# Altium schematic sheet P1.schdoc (part 2 of 3)
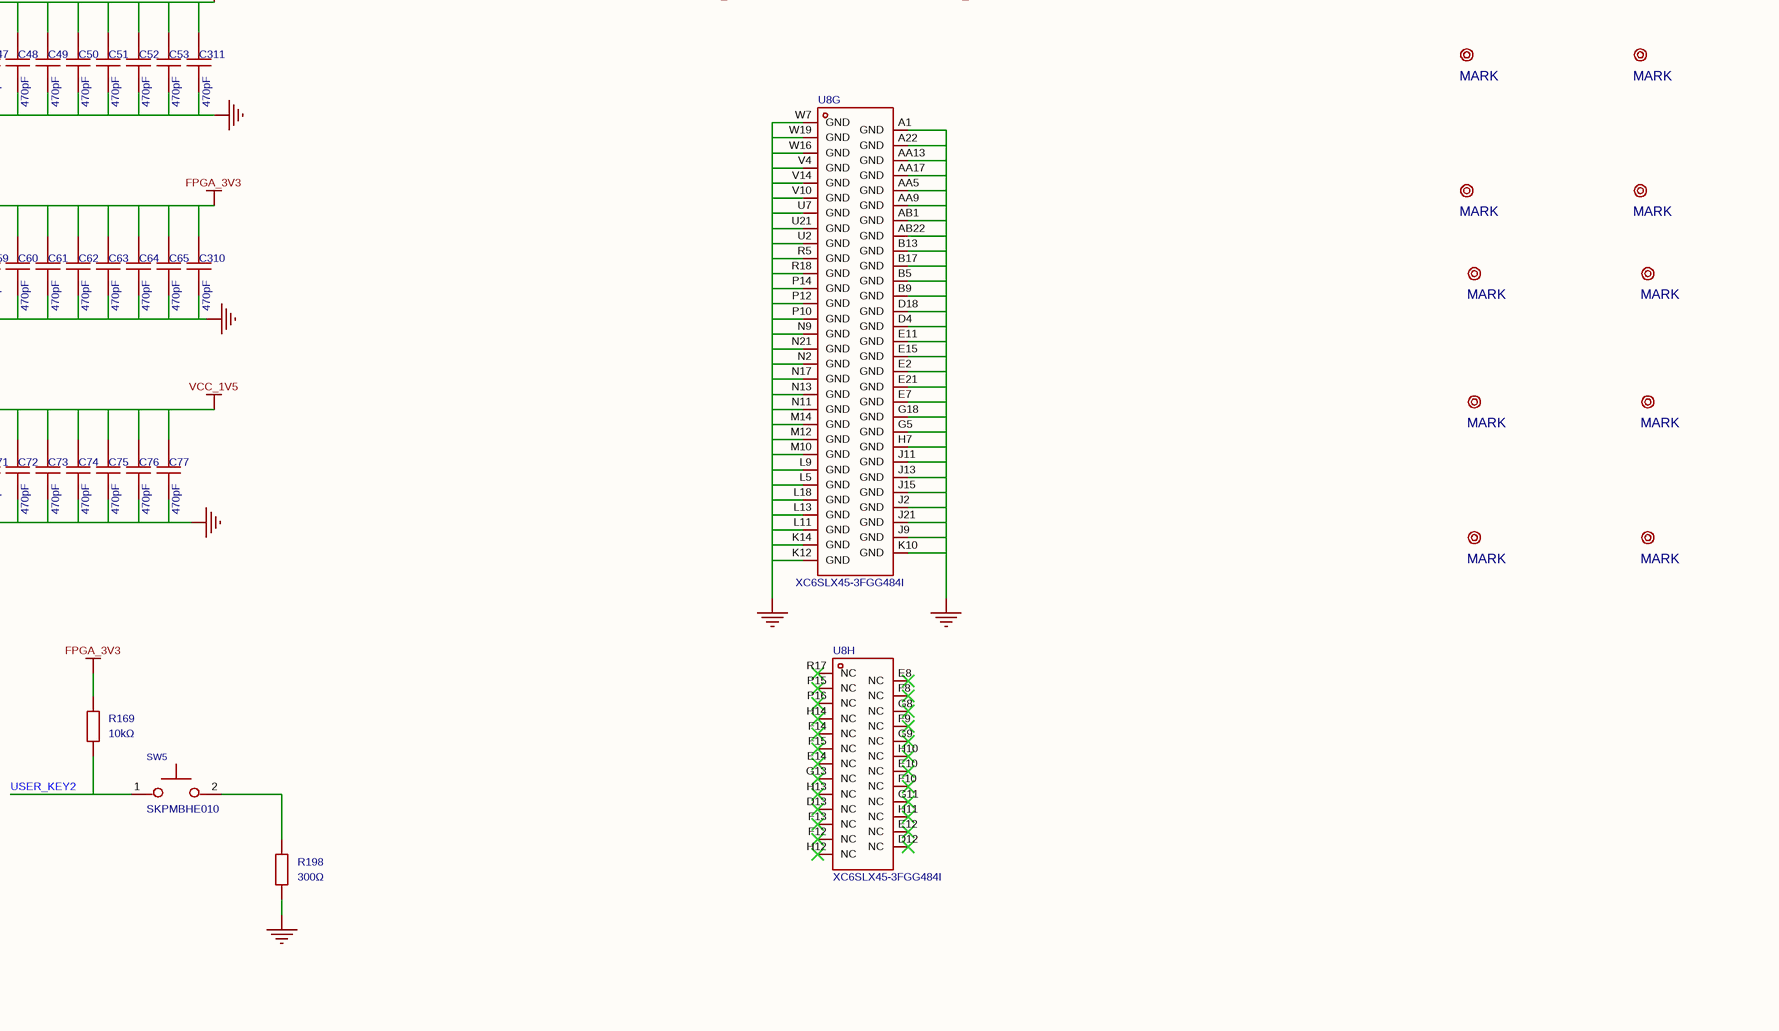
[diagram p12: P1.schdoc, bottom column 4 of 4]
## Library data of the parts
C1-C4 C118 C147-C149 = GRM188R71H104KA93D: 容值:100nF;精度:±10%;额定电压:50V;材质(温度系数):X7R;; Manufacturer: muRata(村田); AddInBom: yes; ModelId: ac125912035d415993ca9572d50418b1; ModelName: C0603_L1.6-W0.8-H0.8; ModelTransform: 62.992,31.496,0,0,0,0,0,0,0; Tolerance: ±10%; Voltage Rated: 50V; Temperature Coefficient: X7R; Symbol: GRM188R71H104KA93D; Device: GRM188R71H104KA93D; LCSC Part Name: 100nF ±10% 50V; SupplierPart: C77055; ManufacturerPart: GRM188R71H104KA93D; Supplier Footprint: 0603; JLCPCB Part Class: 扩展库; Datasheet: https://atta.szlcsc.com/upload/public/pdf/source/20200305/C490387_23319AE8C154DEB24C505E6C82A8106A.pdf; Supplier: LCSC; ConvertToPcb: yes; FootprintName: C0603; Value: 100nF
C5 C17 C30 C42 C54 C66 = GRM32ER60J107ME20L: 容值:100uF;精度:±20%;额定电压:6.3V;材质(温度系数):X5R;; Manufacturer: muRata(村田); AddInBom: yes; ModelId: 113f675d30df4856af7632edb7ada0df; ModelName: C1210_L3.2-W2.5-H0.9; ModelTransform: 125.984,99.2124,0,0,0,0,0,0,0; Tolerance: ±20%; Voltage Rated: 6.3V; Temperature Coefficient: X5R; Symbol: GRM32ER60J107ME20L; Device: GRM32ER60J107ME20L; Supplier: LCSC; Manufacturer Part: GRM32ER60J107ME20L; Value: 100uF; Supplier Part: C88154; JLCPCB Part Class: 扩展库; LCSC Part Name: 100uF ±20% 6.3V; Supplier Footprint: 1210; Datasheet: https://atta.szlcsc.com/upload/public/pdf/source/20170116/1484561244372.pdf; ConvertToPcb: yes; FootprintName: C1210
C6 C18 C29 C31 C43 C55 C67 = GRM188R61C475KE11D: 容值:4.7uF;精度:±10%;额定电压:16V;材质(温度系数):X5R;; Manufacturer: muRata(村田); Symbol: GCM21BR71C475KA73L; AddInBom: yes; ModelId: ac125912035d415993ca9572d50418b1; ModelName: C0603_L1.6-W0.8-H0.8; ModelTransform: 62.992,31.496,0,0,0,0,0,0,0; Tolerance: ±10%; Voltage Rated: 16V; Temperature Coefficient: X5R; Device: GRM188R61C475KE11D; Supplier: LCSC; Manufacturer Part: GRM188R61C475KE11D; Value: 4.7uF; Supplier Part: C77045; JLCPCB Part Class: Extended Part; LCSC Part Name: 4.7uF ±10% 16V; Supplier Footprint: 0603; Datasheet: https://atta.szlcsc.com/upload/public/pdf/source/20200305/C490387_23319AE8C154DEB24C505E6C82A8106A.pdf; ConvertToPcb: yes; FootprintName: C0603
C7-C16 C19-C25 C32-C41 C44-C53 C56-C65 C68-C77 C293-C311 = GRM155R71H471JA01D: 容值:470pF;精度:±5%;额定电压:50V;材质(温度系数):X7R;; Manufacturer: muRata(村田); AddInBom: yes; ModelId: 36a51122f27c49738f86b3bfa98863e0; ModelName: C0402_L1.0-W0.5-H0.5; ModelTransform: 39.37,19.685,0,0,0,0,0,0,0; Tolerance: ±5%; Voltage Rated: 50V; Temperature Coefficient: X7R; JLCPCB Part Class: Extended Part; Symbol: GRM155R71H471JA01D; Device: GRM155R71H471JA01D; Supplier: LCSC; Supplier Part: C415539; Manufacturer Part: GRM155R71H471JA01D; Value: 470pF; LCSC Part Name: 470pF ±5% 50V; Supplier Footprint: 0402; Datasheet: https://atta.szlcsc.com/upload/public/pdf/source/20200305/C490387_23319AE8C154DEB24C505E6C82A8106A.pdf; ConvertToPcb: yes; FootprintName: C0402
C78-C106 C108 C110 C119 C124 C129 C132 C133 C135 C136 C150 C157-C159 C162 C173 C210 C217-C251 = GCM155R71A104KA55D: 容值:100nF;精度:±10%;额定电压:10V;材质(温度系数):X7R;; Manufacturer: muRata(村田); AddInBom: yes; ModelId: 36a51122f27c49738f86b3bfa98863e0; ModelName: C0402_L1.0-W0.5-H0.5; ModelTransform: 39.37,19.685,0,0,0,0,0,0,0; Tolerance: ±10%; Voltage Rated: 10V; Temperature Coefficient: X7R; Symbol: GCM155R71A104KA55D; Device: GCM155R71A104KA55D; LCSC Part Name: 100nF ±10% 10V; SupplierPart: C161163; ManufacturerPart: GCM155R71A104KA55D; Supplier Footprint: 0402; JLCPCB Part Class: 扩展库; Datasheet: https://atta.szlcsc.com/upload/public/pdf/source/20180821/C161163_5F90D1CDF6FD55851A9BB75B6044C401.pdf; Supplier: LCSC; ConvertToPcb: yes; FootprintName: C0402; Value: 100nF
C107 C109 C141-C146 C167 C169 C171 C176 C185-C191 C200 = GCM155R71H103KA55D: 容值:10nF;精度:±10%;额定电压:50V;材质(温度系数):X7R;; Manufacturer: muRata(村田); AddInBom: yes; ModelId: 36a51122f27c49738f86b3bfa98863e0; ModelName: C0402_L1.0-W0.5-H0.5; ModelTransform: 39.37,19.685,0,0,0,0,0,0,0; Tolerance: ±10%; Voltage Rated: 50V; Temperature Coefficient: X7R; Symbol: GCM155R71H103KA55D; Device: GCM155R71H103KA55D; Supplier: LCSC; Manufacturer Part: GCM155R71H103KA55D; Value: 10nF; Supplier Part: C91601; JLCPCB Part Class: 扩展库; LCSC Part Name: 10nF ±10% 50V; Supplier Footprint: 0402; Datasheet: https://atta.szlcsc.com/upload/public/pdf/source/20161226/1482720174418.pdf; ConvertToPcb: yes; FootprintName: C0402
C111 = GRT155R70J105KE01D: 容值:1uF;精度:±10%;额定电压:6.3V;材质(温度系数):X7R;; Manufacturer: muRata(村田); AddInBom: yes; ModelId: 36a51122f27c49738f86b3bfa98863e0; ModelName: C0402_L1.0-W0.5-H0.5; ModelTransform: 39.37,19.685,0,0,0,0,0,0,0; Tolerance: ±10%; Voltage Rated: 6.3V; Temperature Coefficient: X7R; Symbol: GRT155R70J105KE01D; Device: GRT155R70J105KE01D; Supplier: LCSC; Supplier Part: C711581; Manufacturer Part: GRT155R70J105KE01D; Value: 1uF; JLCPCB Part Class: 扩展库; LCSC Part Name: 1uF ±10% 6.3V; Supplier Footprint: 0402; Datasheet: https://atta.szlcsc.com/upload/public/pdf/source/20200724/C711581_B3695B2DBE141281AD92EC24EBBBFB12.pdf; ConvertToPcb: yes; FootprintName: C0402
C112-C117 = CC0402JRNPO9BN330: 容值:33pF;精度:±5%;额定电压:50V;材质(温度系数):NP0;; Manufacturer: YAGEO(国巨); AddInBom: yes; ModelId: 36a51122f27c49738f86b3bfa98863e0; ModelName: C0402_L1.0-W0.5-H0.5; ModelTransform: 39.37,19.685,0,0,0,0,0,0,0; Tolerance: ±5%; Voltage Rated: 50V; Temperature Coefficient: NP0; Symbol: CC0402JRNPO9BN330; Device: CC0402JRNPO9BN330; Supplier: LCSC; Manufacturer Part: CC0402JRNPO9BN330; Value: 33pF; Supplier Part: C107005; JLCPCB Part Class: 扩展库; LCSC Part Name: 33pF ±5% 50V; Supplier Footprint: 0402; Datasheet: https://atta.szlcsc.com/upload/public/pdf/source/20181008/C309499_21CC21451B82C39E3D92150FD6B30293.pdf; ConvertToPcb: yes; FootprintName: C0402
C120-C123 C125 = GRM155R60J226ME11D: 容值:22uF;精度:±20%;额定电压:6.3V;材质(温度系数):X5R;; Manufacturer: muRata(村田); AddInBom: yes; ModelId: 36a51122f27c49738f86b3bfa98863e0; ModelName: C0402_L1.0-W0.5-H0.5; ModelTransform: 39.37,19.685,0,0,0,0,0,0,0; Tolerance: ±20%; Voltage Rated: 6.3V; Temperature Coefficient: X5R; Symbol: GRM155R60J226ME11D; Device: GRM155R60J226ME11D; LCSC Part Name: 22uF ±20% 6.3V; SupplierPart: C415703; ManufacturerPart: GRM155R60J226ME11D; Supplier Footprint: 0402; JLCPCB Part Class: 扩展库; Datasheet: https://atta.szlcsc.com/upload/public/pdf/source/20200305/C490387_23319AE8C154DEB24C505E6C82A8106A.pdf; Supplier: LCSC; ConvertToPcb: yes; FootprintName: C0402; Value: 22uF
C128 = GRM21BR61H106KE43L: 容值:10uF;精度:±10%;额定电压:50V;材质(温度系数):X5R;; Manufacturer: muRata(村田); AddInBom: yes; ModelId: 1ba041120af144c991958decab20d241; ModelName: C0805_L2.0-W1.3-H1.3; ModelTransform: 78.74,51.181,0,0,0,0,0,0.0005,0; Tolerance: ±10%; Voltage Rated: 50V; Temperature Coefficient: X5R; Symbol: GRM21BR61H106KE43L; Device: GRM21BR61H106KE43L; Supplier: LCSC; Supplier Part: C440198; Manufacturer Part: GRM21BR61H106KE43L; Value: 10uF; JLCPCB Part Class: 基础库; LCSC Part Name: 10uF ±10% 50V; Supplier Footprint: 0805; Datasheet: https://atta.szlcsc.com/upload/public/pdf/source/20230811/95AAE0C9AF55EDC31B7A4D8B733F534E.pdf; ConvertToPcb: yes; FootprintName: C0805
C153 C192 = EEEFT1H220AR: 容值:22uF;精度:±20%;额定电压:50V;纹波电流:165mA@100kHz;等效串联电阻:880mΩ@100kHz;; Manufacturer: PANASONIC(松下); AddInBom: yes; ModelId: 16f5696d655347d6a4362817d02ce59a; ModelName: CAP-SMD_BD5.0-L5.3-W5.3-LS5.5-FD; ModelTransform: 216.535,208.661,0,0,0,0,0,0,0; Tolerance: ±20%; Rated Voltage: 50V; φD: 5mm; L: 6.1mm; Lifetime @ Temp: 2000hrs@105℃; Symbol: EEEFT1H220AR; Device: EEEFT1H220AR; Supplier: LCSC; Supplier Part: C336246; Manufacturer Part: EEEFT1H220AR; Value: 22uF; JLCPCB Part Class: 扩展库; LCSC Part Name: 22uF ±20% 50V; Supplier Footprint: SMD,D5xL5.8mm; Datasheet: https://atta.szlcsc.com/upload/public/pdf/source/20190301/C336246_0C4241E5B04A09726274AFCD10460840.pdf; ConvertToPcb: yes; FootprintName: CAP-SMD_BD5.0-L5.3-W5.3-FD; Ripple Current: 165mA@100kHz; Equivalent Series Resistance(ESR): 880mΩ@100kHz; Operating Temperature: -55℃~+105℃
C166 = GCM155R71A104KA55D: 容值:100nF;精度:±10%;额定电压:10V;材质(温度系数):X7R;; Manufacturer: muRata(村田); Symbol: GCM155R71H103KA55D; AddInBom: yes; ModelId: 36a51122f27c49738f86b3bfa98863e0; ModelName: C0402_L1.0-W0.5-H0.5; ModelTransform: 39.37,19.685,0,0,0,0,0,0,0; Tolerance: ±10%; Voltage Rated: 10V; Temperature Coefficient: X7R; JLCPCB Part Class: Extended Part; Device: GCM155R71A104KA55D; Supplier: LCSC; Manufacturer Part: GCM155R71A104KA55D; Value: 100nF; Supplier Part: C161163; LCSC Part Name: 100nF ±10% 10V; Supplier Footprint: 0402; Datasheet: https://atta.szlcsc.com/upload/public/pdf/source/20180821/C161163_5F90D1CDF6FD55851A9BB75B6044C401.pdf; ConvertToPcb: yes; FootprintName: C0402
C178-C184 = 20TQC22MYFB: 容值:22uF;精度:±20%;额定电压:20V;等效串联电阻:90mΩ@100kHz;; Manufacturer: PANASONIC(松下); AddInBom: yes; ModelId: 0dfcda272f9b43668c6086d3a08712ba; ModelName: CASE-B_L3.5-W2.8-H1.9; ModelTransform: 145.669,110.236,0,180,0,0,0,0,0; Tolerance: ±20%; Rated Voltage: 20V; Symbol: 20TQC22MYFB; Device: 20TQC22MYFB; Supplier: LCSC; Supplier Part: C178360; Manufacturer Part: 20TQC22MYFB; Value: 22uF; JLCPCB Part Class: 扩展库; LCSC Part Name: 22uF ±20% 20V; Supplier Footprint: CASE-B-3528; Datasheet: https://atta.szlcsc.com/upload/public/pdf/source/20180327/C178360_45C3E0E4231676737BD215E9C4CFE59C.pdf; ConvertToPcb: yes; FootprintName: CAP-SMD_L3.5-W2.8-R-RD; Equivalent Series Resistance(ESR): 90mΩ@100kHz; Operating Temperature: -55℃~+105℃
C193 C196 C199 = GRM21BR61E106MA73L: 容值:10uF;精度:±20%;额定电压:25V;材质(温度系数):X5R;; Manufacturer: muRata(村田); AddInBom: yes; ModelId: 1ba041120af144c991958decab20d241; ModelName: C0805_L2.0-W1.3-H1.3; ModelTransform: 78.74,51.181,0,0,0,0,0,0.0005,0; Tolerance: ±20%; Voltage Rated: 25V; Temperature Coefficient: X5R; Symbol: GRM21BR61E106MA73L; Device: GRM21BR61E106MA73L; LCSC Part Name: 10uF ±20% 25V; SupplierPart: C391262; ManufacturerPart: GRM21BR61E106MA73L; Supplier Footprint: 0805; JLCPCB Part Class: 扩展库; Datasheet: https://atta.szlcsc.com/upload/public/pdf/source/20190506/C391262_462C1CBD73D7B78D90F3C58083B953A5.pdf; Supplier: LCSC; ConvertToPcb: yes; FootprintName: C0805; Value: 10uF
C194 C197 = GRM21BR61A226ME44L: 容值:22uF;精度:±20%;额定电压:10V;材质(温度系数):X5R;; Manufacturer: muRata(村田); AddInBom: yes; ModelId: 1ba041120af144c991958decab20d241; ModelName: C0805_L2.0-W1.3-H1.3; ModelTransform: 78.74,51.181,0,0,0,0,0,0.0005,0; Tolerance: ±20%; Voltage Rated: 10V; Temperature Coefficient: X5R; Symbol: GRM21BR61A226ME44L; Device: GRM21BR61A226ME44L; LCSC Part Name: 22uF ±20% 10V; SupplierPart: C441864; ManufacturerPart: GRM21BR61A226ME44L; Supplier Footprint: 0805; JLCPCB Part Class: 扩展库; Datasheet: https://atta.szlcsc.com/upload/public/pdf/source/20191031/C441864_62BC1371E70A92C459964A896A97F556.pdf; Supplier: LCSC; ConvertToPcb: yes; FootprintName: C0805; Value: 22uF
C195 C198 = CC0603GRNPO9BN621: 容值:620pF;精度:±2%;额定电压:50V;材质(温度系数):NP0;; Manufacturer: YAGEO(国巨); AddInBom: yes; ModelId: ac125912035d415993ca9572d50418b1; ModelName: C0603_L1.6-W0.8-H0.8; ModelTransform: 62.992,31.496,0,0,0,0,0,0,0; Tolerance: ±2%; Voltage Rated: 50V; Temperature Coefficient: NP0; Symbol: CC0603GRNPO9BN621; Device: CC0603GRNPO9BN621; Supplier: LCSC; Supplier Part: C519479; Manufacturer Part: CC0603GRNPO9BN621; Value: 620pF; JLCPCB Part Class: Extended Part; LCSC Part Name: 620pF ±2% 50V; Supplier Footprint: 0603; Datasheet: https://atta.szlcsc.com/upload/public/pdf/source/20200423/C519479_633E9FC1EA1A4EC891207212FCEBBBE4.pdf; ConvertToPcb: yes; FootprintName: C0603
C201 = GCM155R71H822KA55D: 容值:8.2nF;精度:±10%;额定电压:50V;材质(温度系数):X7R;; Manufacturer: muRata(村田); AddInBom: yes; ModelId: 36a51122f27c49738f86b3bfa98863e0; ModelName: C0402_L1.0-W0.5-H0.5; ModelTransform: 39.37,19.685,0,0,0,0,0,0,0; Tolerance: ±10%; Voltage Rated: 50V; Temperature Coefficient: X7R; Symbol: GCM155R71H822KA55D; Device: GCM155R71H822KA55D; Supplier: LCSC; Supplier Part: C161172; Manufacturer Part: GCM155R71H822KA55D; Value: 8.2nF; JLCPCB Part Class: 扩展库; LCSC Part Name: 8.2nF ±10% 50V; Supplier Footprint: 0402; Datasheet: https://atta.szlcsc.com/upload/public/pdf/source/20191226/C475964_3FAF76C90CD8FFB09F50C7480ADA926F.pdf; ConvertToPcb: yes; FootprintName: C0402
C202 = CC0603KRX7R9BB104: 容值:100nF;精度:±10%;额定电压:50V;材质(温度系数):X7R;; Manufacturer: YAGEO(国巨); Symbol: GCM155R71A104KA55D; AddInBom: yes; ModelId: ac125912035d415993ca9572d50418b1; ModelName: C0603_L1.6-W0.8-H0.8; ModelTransform: 62.992,31.496,0,0,0,0,0,0,0; Tolerance: ±10%; Voltage Rated: 50V; Temperature Coefficient: X7R; Device: CC0603KRX7R9BB104; LCSC Part Name: 100nF ±10% 50V; SupplierPart: C14663; ManufacturerPart: CC0603KRX7R9BB104; Supplier Footprint: 0603; JLCPCB Part Class: Basic Part; Datasheet: https://atta.szlcsc.com/upload/public/pdf/source/20180910/C282072_33301C7F631E79921B82A8DAC6BCC5B3.pdf; Supplier: LCSC; ConvertToPcb: yes; FootprintName: C0603; Value: 100nF
C204-C209 C211-C216 C312 C313 = GRM32ER71E226KE15L: 容值:22uF;精度:±10%;额定电压:25V;材质(温度系数):X7R;; Manufacturer: muRata(村田); AddInBom: yes; ModelId: 113f675d30df4856af7632edb7ada0df; ModelName: C1210_L3.2-W2.5-H0.9; ModelTransform: 125.984,99.2124,0,0,0,0,0,0,0; Tolerance: ±10%; Voltage Rated: 25V; Temperature Coefficient: X7R; Symbol: GRM32ER71E226KE15L; Device: GRM32ER71E226KE15L; Supplier: LCSC; Supplier Part: C21397; Manufacturer Part: GRM32ER71E226KE15L; Value: 22uF; JLCPCB Part Class: 扩展库; LCSC Part Name: 22uF ±10% 25V; Supplier Footprint: 1210; Datasheet: https://atta.szlcsc.com/upload/public/pdf/source/20230811/6AA9DB9766E5496748A2F980D0C94A94.pdf; ConvertToPcb: yes; FootprintName: C1210
C259 C260 = GRM31CR61A107ME05L: 容值:100uF;精度:±20%;额定电压:10V;材质(温度系数):X5R;; Manufacturer: muRata(村田); AddInBom: yes; ModelId: e4be705b945545a48e666415e3682bd8; ModelName: C1206_L3.2-W1.6-H1.3; ModelTransform: 125.984,62.992,0,0,0,0,0,0,0; Tolerance: ±20%; Voltage Rated: 10V; Temperature Coefficient: X5R; Symbol: GRM31CR61A107ME05L; Device: GRM31CR61A107ME05L; Supplier: LCSC; Supplier Part: C312983; Manufacturer Part: GRM31CR61A107ME05L; Value: 100uF; JLCPCB Part Class: 扩展库; LCSC Part Name: 100uF ±20% 10V; Supplier Footprint: 1206; Datasheet: https://atta.szlcsc.com/upload/public/pdf/source/20181029/C312983_F99DFC7E8AF2C04CC95A01A8A93C8DA6.pdf; ConvertToPcb: yes; FootprintName: C1206
C261-C292 = GRM155R71H473KE14D: 容值:47nF;精度:±10%;额定电压:50V;材质(温度系数):X7R;; Manufacturer: muRata(村田); AddInBom: yes; ModelId: 36a51122f27c49738f86b3bfa98863e0; ModelName: C0402_L1.0-W0.5-H0.5; ModelTransform: 39.37,19.685,0,0,0,0,0,0,0; Tolerance: ±10%; Voltage Rated: 50V; Temperature Coefficient: X7R; Symbol: GRM155R71H473KE14D; Device: GRM155R71H473KE14D; Supplier: LCSC; Supplier Part: C117757; Manufacturer Part: GRM155R71H473KE14D; Value: 47nF; JLCPCB Part Class: 扩展库; LCSC Part Name: 47nF ±10% 50V; Supplier Footprint: 0402; Datasheet: https://atta.szlcsc.com/upload/public/pdf/source/20210603/E8EBCABCAAB27DB371D44E2147CEB0E7.pdf; ConvertToPcb: yes; FootprintName: C0402
CN2 = 2.54-2*5P简牛: 连接器类型:简牛座;间距:2.54mm;结构:2x5P;封装形式:直插;行距:2.54mm;排数:2;每排PIN数:5;触头材质:-;触头镀层:-;; Manufacturer: BOOMELE(博穆精密); Pins Structure: 2x5P; Number of PINs Per Row: 5; Symbol: 878311020; AddInBom: yes; ModelId: 1d28e50a904749439e5167098e48e984; ModelName: HDR-IDC-2.54-2X5P; ModelTransform: 799.998,348.41478,0,0,0,0,0,3.937,-118.11; Connector Type: 简牛座; Pitch: 2.54mm; Holder Type: 直插; Mounting Style: 直插; Reference Series: -; Number of Pins: 10P; Current Rating (Max): -; Operating Temperature Range: -; Device: 2.54-2*5P简牛; Supplier: LCSC; Supplier Part: C5665; Manufacturer Part: 2.54-2*5P简牛; JLCPCB Part Class: Extended Part; LCSC Part Name: 2.54mm 2x5P 排数:2 每排P数:5; Supplier Footprint: 插件,P=2.54mm; Datasheet: https://atta.szlcsc.com/upload/public/pdf/source/20140331/1457707037896.pdf; ConvertToPcb: yes; FootprintName: IDC-TH_10P-P2.54_C5665; Structure: 2x5P; Row Spacing: 2.54mm; Number of Rows: 2; Pin Number in each Row: 5; Contact Material: -; Contact Plating: -
D1-D4 = BAT54S,215: 二极管配置:1对串联式;正向压降(Vf):800mV@100mA;直流反向耐压(Vr):30V;平均整流电流(Io):200mA;; Manufacturer: Nexperia(安世); AddInBom: yes; ModelId: 89cb27a44ab2466697082bb9fd73a7d0; ModelName: SOT-23-3L_L2.9-W1.6-H1.1-LS2.8-P0.95; ModelTransform: 114.173,110.236,0,90,0,0,0,0,0; Diode Configuration: 1对串联式; Reverse Voltage (Vr): 30V; Average Rectified Current (Io): 200mA; Reverse Leakage Current (Ir): 2uA@25V; Symbol: BAT54S,215; Device: BAT54S,215; Supplier: LCSC; Manufacturer Part: BAT54S,215; Supplier Part: C47546; JLCPCB Part Class: 扩展库; LCSC Part Name: 电压:30V 电流:200mA; Supplier Footprint: SOT-23; Datasheet: https://atta.szlcsc.com/upload/public/pdf/source/20180326/C130910_AAC331EF45C4B7D7866DD336DA3C5D86.pdf; ConvertToPcb: yes; FootprintName: SOT-23-3_L3.0-W1.7-P0.95-LS2.9-BR; Forward Voltage (Vf@If): 800mV@100mA
D5 D11 = SS14_C2480: 二极管配置:独立式;正向压降(Vf):550mV@1A;直流反向耐压(Vr):40V;平均整流电流(Io):1A;; Manufacturer: MDD; AddInBom: yes; ModelId: c9e8185d46a94015b9fa58a531b156cf; ModelTransform: 204.83943,103.346,0,0,0,0,-0.001,0.001,0; Diode Configuration: 独立式; Reverse Voltage (Vr): 40V; Average Rectified Current (Io): 1A; Reverse Leakage Current (Ir): 500uA@40V; Symbol: SS14; Device: SS14_C2480; Supplier: LCSC; Manufacturer Part: SS14; Supplier Part: C2480; JLCPCB Part Class: 基础库; LCSC Part Name: 电压:40V 电流:1A; Supplier Footprint: SMA(DO-214AC); Datasheet: https://atta.szlcsc.com/upload/public/pdf/source/20230712/2DB6064CFBB99DE6DB116BEE8208BE66.pdf; ConvertToPcb: yes; FootprintName: SMA_L4.2-W2.6-LS5.3-RD; ModelName: SMA_L4.2-W2.6-LS5.3-RD; Forward Voltage (Vf@If): 550mV@1A
D6 D12 D16 = IP4220CZ6: Manufacturer: UMW(友台半导体); AddInBom: yes; ModelId: 396be7ac4a944b019708673e9658f3cc; ModelTransform: 108.2675,102.362,0,0,0,0,0,0,0; Type: ESD; Symbol: IP4220CZ6; Device: IP4220CZ6; LCSC Part Name: IP4220CZ6; SupplierPart: C2687127; ManufacturerPart: IP4220CZ6; Supplier Footprint: SOT-23-6; JLCPCB Part Class: 扩展库; Datasheet: https://atta.szlcsc.com/upload/public/pdf/source/20231109/3364A785CFEC7CDA53E35AFD71B7CF40.pdf; Supplier: LCSC; ConvertToPcb: yes; FootprintName: SOT-23-6_L2.9-W1.6-P0.95-LS2.7-BL; ModelName: SOT-23-6_L2.9-W1.6-P0.95-LS2.7-BL
D7 D8 D13 D14 = RClamp0524P.TCT: 反向截止电压(Vrwm):5V;最大钳位电压:15V;峰值脉冲电流(Ipp)@10/1000us:5A@8/20us;击穿电压:6V;; Manufacturer: SEMTECH; AddInBom: yes; ModelId: 023e7a6a330346aa9357cf6275e895ab; ModelName: SLP2510-8P_L2.5-W1.0-H0.5; ModelTransform: 98.425,40.1574,0,0,0,0,0,0,0; Reverse Stand-Off Voltage (Vrwm): 5V; Maximum Clamping Voltage: 15V; Breakdown Voltage: 6V; Type: TVS; Symbol: RCLAMP0524P.TCT; Device: RClamp0524P.TCT; Supplier: LCSC; Manufacturer Part: RClamp0524P.TCT; Supplier Part: C132263; JLCPCB Part Class: 扩展库; LCSC Part Name: 单向TVS 5V截止 5A峰值脉冲; Supplier Footprint: UFDFN-10; Datasheet: https://atta.szlcsc.com/upload/public/pdf/source/20180424/C132263_B0BFC85CCBF796A00ABDE4383E96B9E0.pdf; ConvertToPcb: yes; FootprintName: SLP2510P8_L2.5-W1.0-P0.50-BL; Peak Pulse Current (Ipp)@10/1000us: 5A@8/20us
D17 = B230A-13-F: 正向压降(Vf):500mV@2A;直流反向耐压(Vr):30V;平均整流电流(Io):2A;; Manufacturer: DIODES(美台); AddInBom: yes; ModelId: a2d22152f8d5421c8e96dbd56af7c345; ModelTransform: 204.724,98.425,0,0,0,0,0,0,0; Reverse Voltage (Vr): 30V; Average Rectified Current (Io): 2A; Reverse Leakage Current (Ir): 500uA@30V; Symbol: B230A-13-F; Device: B230A-13-F; Supplier: LCSC; Manufacturer Part: B230A-13-F; Supplier Part: C12889; JLCPCB Part Class: 扩展库; LCSC Part Name: 电压:30V 电流:2A; Supplier Footprint: SMA(DO-214AC); Datasheet: https://atta.szlcsc.com/upload/public/pdf/source/20191129/C460673_65E0A67BF9F553882F22D2B39F8BCAEF.pdf; ConvertToPcb: yes; FootprintName: SMA_L4.4-W2.6-LS5.0-RD; ModelName: SMA_L4.4-W2.6-LS5.0-RD; Forward Voltage (Vf@If): 500mV@2A
D20 D21 = BZT52H-B5V6,115: 二极管配置:独立式;稳压值(标称值):5.6V;稳压值(范围):5.49V~5.71V;功率:375mW;精度:±2%;; Manufacturer: Nexperia(安世); AddInBom: yes; ModelId: a099669e960c4e6d91214e62d8e45b94; ModelTransform: 137.795,62.992,0,0,0,0,0,0,0; Diode Configuration: 独立式; Zener Voltage (Nom): 5.6V; Reverse Leakage Current (Ir): 1uA@2V; Power Dissipation: 375mW; Zener Impedance (Zzt): 40Ω; Tolerance: ±2%; Symbol: BZT52H-B5V6,115; Device: BZT52H-B5V6,115; LCSC Part Name: BZT52H-B5V6,115; SupplierPart: C426804; ManufacturerPart: BZT52H-B5V6,115; Supplier Footprint: SOD-123F; JLCPCB Part Class: 扩展库; Datasheet: https://atta.szlcsc.com/upload/public/pdf/source/20200310/C493582_3AB991C7AA86494D92E4C7FA68C6C679.pdf; Supplier: LCSC; ConvertToPcb: yes; FootprintName: SOD-123F_L2.6-W1.6-LS3.5-RD; ModelName: SOD-123F_L2.6-W1.6-LS3.5-RD; Zener Voltage (Range): 5.49V~5.71V
D22-D25 = BAT54A,215: 二极管配置:1对共阳极;直流反向耐压(Vr):30V;平均整流电流(Io):200mA;; Manufacturer: Nexperia(安世); AddInBom: yes; ModelId: 89cb27a44ab2466697082bb9fd73a7d0; ModelName: SOT-23-3L_L2.9-W1.6-H1.1-LS2.8-P0.95; ModelTransform: 114.173,110.236,0,90,0,0,0,0,0; Diode Configuration: 1对共阳极; Reverse Voltage (Vr): 30V; Average Rectified Current (Io): 200mA; Reverse Leakage Current (Ir): 2uA@25V; Symbol: BAT54A,215; Device: BAT54A,215; LCSC Part Name: 电压:30V 电流:200mA; SupplierPart: C130910; ManufacturerPart: BAT54A,215; Supplier Footprint: SOT-23; JLCPCB Part Class: 扩展库; Datasheet: https://atta.szlcsc.com/upload/public/pdf/source/20180326/C130910_AAC331EF45C4B7D7866DD336DA3C5D86.pdf; Supplier: LCSC; ConvertToPcb: yes; FootprintName: SOT-23-3_L3.0-W1.7-P0.95-LS2.9-BR
DC3 = DC-091-A250: 连接器类型:DC电源插座;安装方式:弯插;触点内径:2.5mm;触点外径:6.45mm;额定电流:5A;额定电压:24V;工作温度范围:-30℃~+70℃;; Manufacturer: XUNPU(讯普); AddInBom: yes; ModelId: 71712f683e0d4b868f9bba5c6e495897; ModelTransform: 511.81,393.7,0,0,0,0,-94.488,0,-118.11; Connector Type: DC电源插座; Inside Contact Diameter: 2.5mm; Outside Contact Diameter: 6.45mm; Current Rating (Max): 5A; Voltage Rating (Max): 24V; Symbol: DC-091-A250; Device: DC-091-A250; Supplier: LCSC; Supplier Part: C720588; Manufacturer Part: DC-091-A250; JLCPCB Part Class: 扩展库; LCSC Part Name: DC电源插座 内径:2.5mm 外径:6.45mm; Supplier Footprint: 插件; Datasheet: https://atta.szlcsc.com/upload/public/pdf/source/20211022/4405C4A6464D514B1AFE6C16257EC3E0.pdf; ConvertToPcb: yes; FootprintName: DC-IN-TH_DC-091-A250; ModelName: DC-IN-TH_DC-091-A250; Mounting Style: 弯插; Operating Temperature Range: -30℃~+70℃
DSUB1 = DZ11A51-H8R1-4F: 连接器类型:D-Sub;公母:母;总PIN位数:15P;安装方式:弯插;排数:3;额定电流:2A;工作温度范围:-20℃~+85℃;; Manufacturer: FOXCONN(富士康); AddInBom: yes; ModelId: f71f5ba0ab124dc38293d45624ab7326; ModelName: DSUB-TH_L30.8-W10.6-H10.0-DZ11A5X-H8R1-4F; ModelTransform: 1212.596,416.141,0,0,0,0,-0.004,-118.621,-118.11; Connector Type: D-Sub; Gender: 母; Current Rating (Max): 2A; Symbol: DZ11A51-H8R1-4F; Device: DZ11A51-H8R1-4F; LCSC Part Name: D-Sub 母 P数:15P; SupplierPart: C426220; ManufacturerPart: DZ11A51-H8R1-4F; Supplier Footprint: 弯插; JLCPCB Part Class: 扩展库; Datasheet: https://atta.szlcsc.com/upload/public/pdf/source/20190911/C426220_BF5900F2F92AD7EA473E1CE4B7E1A4D4.pdf; Supplier: LCSC; ConvertToPcb: yes; FootprintName: DSUB-TH_DZ11A5X-H8R1-4F; Number of Pins: 15P; Mounting Style: 弯插; Number of Rows: 3; Operating Temperature Range: -20℃~+85℃
F1 = 1812L200THPR: 最大电压:8V;最大电流:100A;保持电流:2A;跳闸电流:3.5A;; Manufacturer: Littelfuse(美国力特); AddInBom: yes; ModelId: bca21e458c564d38b781621ca22e660b; ModelName: F1812_L4.5-W3.2-H1.0; ModelTransform: 177.165,125.984,0,0,0,0,0.0005,0,0; Operating Voltage (Max): 8V; Current Rating (Max): 100A; Hold Current: 2A; Trip Current: 3.5A; Resistance - Initial (Ri) (Min): 20mΩ; Resistance - Post Trip (R1) (Max): 70mΩ; Maximum Time to Trip: 2s; Symbol: 1812L200THPR; Device: 1812L200THPR; Supplier: LCSC; Supplier Part: C207074; Manufacturer Part: 1812L200THPR; JLCPCB Part Class: 扩展库; LCSC Part Name: 8V 2A 1812自恢复; Supplier Footprint: 1812; Datasheet: https://atta.szlcsc.com/upload/public/pdf/source/20181031/C315901_C3D1AA68B7E2FCFB6B7163300867CF3D.pdf; ConvertToPcb: yes; FootprintName: F1812; Power Dissipation: -; Operating Temperature: -40℃~+85℃
F2 = 1812L300MR: 最大电压:6V;最大电流:100A;保持电流:3A;跳闸电流:5A;; Manufacturer: Littelfuse(美国力特); Symbol: 1812L200THPR; AddInBom: yes; ModelId: bca21e458c564d38b781621ca22e660b; ModelName: F1812_L4.5-W3.2-H1.0; ModelTransform: 177.165,125.984,0,0,0,0,0.0005,0,0; Operating Voltage (Max): 6V; Current Rating (Max): 100A; Hold Current: 3A; Trip Current: 5A; Resistance - Initial (Ri) (Min): 12mΩ; Resistance - Post Trip (R1) (Max): 40mΩ; Maximum Time to Trip: 4s; Device: 1812L300MR; Supplier: LCSC; Supplier Part: C127824; Manufacturer Part: 1812L300MR; JLCPCB Part Class: Extended Part; LCSC Part Name: 6V 3A 1812自恢复; Supplier Footprint: 1812; Datasheet: https://atta.szlcsc.com/upload/public/pdf/source/20181031/C315901_C3D1AA68B7E2FCFB6B7163300867CF3D.pdf; ConvertToPcb: yes; FootprintName: F1812; Power Dissipation: -; Operating Temperature: -40℃~+85℃
L1 = GZ2012D601TF: 标称阻抗@测试频率:600Ω@100MHz;误差:±25%;直流电阻(RDC):300mΩ;; Manufacturer: Sunlord(顺络); Value: 600Ω; AddInBom: yes; ModelId: 37a81e68749a4138bd2dfa6897b24b85; ModelName: R0805_L2.0-W1.3-H0.6; ModelTransform: 78.74,51.181,0,0,0,0,0,0.001,0; Tolerance: ±25%; DC Resistance: 300mΩ; Current Rating: 500mA; Circuits: 1; Symbol: GZ2012D601TF; Device: GZ2012D601TF; Supplier: LCSC; Manufacturer Part: GZ2012D601TF; Supplier Part: C1017; JLCPCB Part Class: 基础库; LCSC Part Name: 单路 0805磁珠 阻抗600Ω@100MHz; Supplier Footprint: 0805; Datasheet: https://atta.szlcsc.com/upload/public/pdf/source/20231030/9B6A3E87682CEC1FF6638DFAA81D73FA.pdf; ConvertToPcb: yes; FootprintName: L0805; Impedance @ Frequency: 600Ω@100MHz
L2-L8 L33 = BLM18RK601SN1D: 标称阻抗@测试频率:600Ω@100MHz;误差:±25%;直流电阻(RDC):600mΩ;; Manufacturer: muRata(村田); AddInBom: yes; ModelId: 2bc5ec593d464d6ba9807aec0b5673c2; ModelName: L0603_L1.6-W0.8-H0.5_BEAD; ModelTransform: 62.992,31.496,0,180,0,0,0.094,0.629,0; Tolerance: ±25%; DC Resistance: 600mΩ; Current Rating: 200mA; Circuits: 1; Symbol: BLM18RK601SN1D; Device: BLM18RK601SN1D; LCSC Part Name: 单路 0603磁珠 阻抗600Ω@100MHz; SupplierPart: C88987; ManufacturerPart: BLM18RK601SN1D; Supplier Footprint: 0603; JLCPCB Part Class: 扩展库; Datasheet: https://atta.szlcsc.com/upload/public/pdf/source/20180329/C160981_FD3C2D2622A377E203B89F4AA32B0741.pdf; Supplier: LCSC; ConvertToPcb: yes; FootprintName: L0603; Impedance @ Frequency: 600Ω@100MHz
L22 L24 L26 = MWSA0603S-2R2MT: 精度:±20%;电感值:2.2uH;直流电阻(DCR):15mΩ;额定电流:9.5A;; Manufacturer: Sunlord(顺络); AddInBom: yes; ModelId: 6860c29aec394a38a0f014af7f722a42; ModelName: IND-SMD_L7.0-W6.6-H3.0; ModelTransform: 275.59,259.842,0,0,0,0,0,0,0; Tolerance: ±20%; DC Resistance (DCR): 15mΩ; Rated Current: 9.5A; Symbol: MWSA0603S-2R2MT; Device: MWSA0603S-2R2MT; LCSC Part Name: 2.2uH ±20%; SupplierPart: C408445; ManufacturerPart: MWSA0603S-2R2MT; Supplier Footprint: SMD; JLCPCB Part Class: 扩展库; Datasheet: https://atta.szlcsc.com/upload/public/pdf/source/20190729/C408445_4286F301FFB17FE93B4CE8B15A01B108.pdf; Supplier: LCSC; ConvertToPcb: yes; FootprintName: IND-SMD_L7.0-W6.6; Width: 7mm; Length: 6.6mm; Height: 3mm; Value: 2.2uH
L23 L25 L27 = BLM18SG121TN1D: 标称阻抗@测试频率:120Ω@100MHz;误差:±25%;直流电阻(RDC):25mΩ;; Manufacturer: muRata(村田); AddInBom: yes; ModelId: 2bc5ec593d464d6ba9807aec0b5673c2; ModelName: L0603_L1.6-W0.8-H0.5_BEAD; ModelTransform: 62.992,31.496,0,180,0,0,0.094,0.629,0; Tolerance: ±25%; DC Resistance: 25mΩ; Current Rating: 3A; Circuits: 1; Symbol: BLM18SG121TN1D; Device: BLM18SG121TN1D; LCSC Part Name: 单路 0603磁珠 阻抗120Ω@100MHz; SupplierPart: C113030; ManufacturerPart: BLM18SG121TN1D; Supplier Footprint: 0603; JLCPCB Part Class: 扩展库; Datasheet: https://atta.szlcsc.com/upload/public/pdf/source/20170523/1495533956547.pdf; Supplier: LCSC; ConvertToPcb: yes; FootprintName: L0603; Impedance @ Frequency: 120Ω@100MHz
L28-L32 L34 = FXL0630-2R2-M: 电感值:2.2uH;精度:±20%;额定电流:9.5A;饱和电流(Isat):10A;类型:一体成型电感;; Manufacturer: cjiang(长江微电); AddInBom: yes; ModelId: 6860c29aec394a38a0f014af7f722a42; ModelName: IND-SMD_L7.0-W6.6-H3.0; ModelTransform: 275.59,259.842,0,0,0,0,0,0,0; Tolerance: ±20%; Rated Current: 9.5A; Saturation Current (Isat): 10A; DC Resistance (DCR): 15mΩ; Type: 一体成型电感; Symbol: FXL0630-2R2-M; Device: FXL0630-2R2-M; LCSC Part Name: 2.2uH ±20% 10A; SupplierPart: C167218; ManufacturerPart: FXL0630-2R2-M; Supplier Footprint: SMD,6.6x7mm; JLCPCB Part Class: 扩展库; Datasheet: https://atta.szlcsc.com/upload/public/pdf/source/20230516/3A080F5AF8C87BB81C3BA86E5F60E51A.pdf; Supplier: LCSC; ConvertToPcb: yes; FootprintName: IND-SMD_L7.0-W6.6; Value: 2.2uH
LED1 = 19-22/R6GHC-A32/2T: 发光颜色:红色,翠绿色;; Manufacturer: EVERLIGHT(亿光); AddInBom: yes; ModelId: 4bf13ebd1a8945cf9bcd18e68cfdda16; ModelName: LED-ARRAY-SMD_4P-L1.9-W1.6-H0.8-P0.9; ModelTransform: 75.59,62.992,0,0,0,0,0,0,0; Emitted Color: 红色,翠绿色; Symbol: 19-22/R6GHC-A32/2T; Device: 19-22/R6GHC-A32/2T; LCSC Part Name: 红灯,翠绿; SupplierPart: C131262; ManufacturerPart: 19-22/R6GHC-A32/2T; Supplier Footprint: SMD,1.6x1.9mm; JLCPCB Part Class: 扩展库; Datasheet: https://atta.szlcsc.com/upload/public/pdf/source/20190823/C131262_49B5A7C0BC4F6F8B722BD944169D9F6C.pdf; Supplier: LCSC; ConvertToPcb: yes; FootprintName: LED-ARRAY-SMD_4P-L1.9-W1.6-BL-CW
Q1-Q16 = 2N7002_C8545: 类型:N沟道;漏源电压(Vdss):60V;连续漏极电流(Id):115mA;功率(Pd):200mW;导通电阻(RDS(on)@Vgs,Id):7.5Ω@10V,500mA;阈值电压(Vgs(th)@Id):2.5V@250uA;; Manufacturer: CJ(江苏长电/长晶); AddInBom: yes; ModelId: c62791f0466c4ae2a892c056b845b0ca; ModelName: SOT-23-3P_L2.9-W1.3-H1.0-LS2.4-P0.95; ModelTransform: 98.425,114.173,0,180,0,0,0.0005,-0.0005,0; Type: N沟道; Drain Source Voltage (Vdss): 60V; Continuous Drain Current (Id): 115mA; Power Dissipation (Pd): 200mW; Symbol: 2N7002; Device: 2N7002_C8545; LCSC Part Name: N沟道 耐压:60V 电流:115mA; SupplierPart: C8545; ManufacturerPart: 2N7002; Supplier Footprint: SOT-23; JLCPCB Part Class: 基础库; Datasheet: https://atta.szlcsc.com/upload/public/pdf/source/20171228/C164913_15144413269051213916.pdf; Supplier: LCSC; ConvertToPcb: yes; FootprintName: SOT-23-3_L2.9-W1.3-P1.90-LS2.4-BR; Drain Source On Resistance (RDS(on)@Vgs,Id): 7.5Ω@10V,500mA; Gate Threshold Voltage (Vgs(th)@Id): 2.5V@250uA
R1 R2 R5 R15-R17 R23 R51 R52 = RC0402FR-074K7L: 电阻类型:厚膜电阻;阻值:4.7kΩ;精度:±1%;功率:62.5mW;最大工作电压:50V;温度系数:±100ppm/℃;; Manufacturer: YAGEO(国巨); AddInBom: yes; ModelId: 671aefced39d4c318694bba8bd8efd39; ModelName: R0402_L1.0-W0.5-H0.5; ModelTransform: 39.37,19.685,0,0,0,0,0,0.0005,0; Tolerance: ±1%; Power(Watts): 62.5mW; Overload Voltage (Max): 50V; Symbol: RC0402FR-074K7L; Device: RC0402FR-074K7L; LCSC Part Name: 厚膜电阻 4.7kΩ ±1% 62.5mW; SupplierPart: C105871; ManufacturerPart: RC0402FR-074K7L; Supplier Footprint: 0402; JLCPCB Part Class: 扩展库; Datasheet: https://atta.szlcsc.com/upload/public/pdf/source/20180821/C275644_0D56F95EFF785E7D9A1FEF436B37DA78.pdf; Supplier: LCSC; ConvertToPcb: yes; FootprintName: R0402; Type: 厚膜电阻; Value: 4.7kΩ; Temperature Coefficient: ±100ppm/℃; Operating Temperature Range: -55℃~+155℃
R6 R7 R11-R14 R19-R22 R151-R153 R159 R160 R184 R190 = RC0402FR-0733RL: 电阻类型:厚膜电阻;阻值:33Ω;精度:±1%;功率:62.5mW;最大工作电压:50V;温度系数:±100ppm/℃;; Manufacturer: YAGEO(国巨); AddInBom: yes; ModelId: 671aefced39d4c318694bba8bd8efd39; ModelName: R0402_L1.0-W0.5-H0.5; ModelTransform: 39.37,19.685,0,0,0,0,0,0.0005,0; Tolerance: ±1%; Power(Watts): 62.5mW; Overload Voltage (Max): 50V; Symbol: RC0402FR-0733RL; Device: RC0402FR-0733RL; LCSC Part Name: 厚膜电阻 33Ω ±1% 62.5mW; SupplierPart: C138002; ManufacturerPart: RC0402FR-0733RL; Supplier Footprint: 0402; JLCPCB Part Class: 扩展库; Datasheet: https://atta.szlcsc.com/upload/public/pdf/source/20181009/C309620_DA5935B6E1D48212CB7A533FE518B3C2.pdf; Supplier: LCSC; ConvertToPcb: yes; FootprintName: R0402; Type: 厚膜电阻; Value: 33Ω; Temperature Coefficient: ±100ppm/℃; Operating Temperature Range: -55℃~+155℃
R18 R149 R154 R185 R196-R198 = RC0402FR-07300RL: 电阻类型:厚膜电阻;阻值:300Ω;精度:±1%;功率:62.5mW;最大工作电压:50V;温度系数:±100ppm/℃;; Manufacturer: YAGEO(国巨); AddInBom: yes; ModelId: 671aefced39d4c318694bba8bd8efd39; ModelName: R0402_L1.0-W0.5-H0.5; ModelTransform: 39.37,19.685,0,0,0,0,0,0.0005,0; Tolerance: ±1%; Power(Watts): 62.5mW; Overload Voltage (Max): 50V; Symbol: RC0402FR-07300RL; Device: RC0402FR-07300RL; LCSC Part Name: 厚膜电阻 300Ω ±1% 62.5mW; SupplierPart: C138010; ManufacturerPart: RC0402FR-07300RL; Supplier Footprint: 0402; JLCPCB Part Class: 扩展库; Datasheet: https://atta.szlcsc.com/upload/public/pdf/source/20181009/C309620_DA5935B6E1D48212CB7A533FE518B3C2.pdf; Supplier: LCSC; ConvertToPcb: yes; FootprintName: R0402; Type: 厚膜电阻; Value: 300Ω; Temperature Coefficient: ±100ppm/℃; Operating Temperature Range: -55℃~+155℃
R24 R25 R139 = RC0402FR-07100KL: 电阻类型:厚膜电阻;阻值:100kΩ;精度:±1%;功率:62.5mW;最大工作电压:50V;温度系数:±100ppm/℃;; Manufacturer: YAGEO(国巨); AddInBom: yes; ModelId: 671aefced39d4c318694bba8bd8efd39; ModelName: R0402_L1.0-W0.5-H0.5; ModelTransform: 39.37,19.685,0,0,0,0,0,0.0005,0; Tolerance: ±1%; Power(Watts): 62.5mW; Overload Voltage (Max): 50V; Symbol: RC0402FR-07100KL; Device: RC0402FR-07100KL; LCSC Part Name: 厚膜电阻 100kΩ ±1% 62.5mW; SupplierPart: C60491; ManufacturerPart: RC0402FR-07100KL; Supplier Footprint: 0402; JLCPCB Part Class: 扩展库; Datasheet: https://atta.szlcsc.com/upload/public/pdf/source/20180927/C295883_E8D83085EA81BD7DE0B2B681138C15EE.pdf; Supplier: LCSC; ConvertToPcb: yes; FootprintName: R0402; Type: 厚膜电阻; Value: 100kΩ; Temperature Coefficient: ±100ppm/℃; Operating Temperature Range: -55℃~+155℃
R26 R53 = RC0402FR-07240RL: 电阻类型:厚膜电阻;阻值:240Ω;精度:±1%;功率:62.5mW;最大工作电压:50V;温度系数:±100ppm/℃;; Manufacturer: YAGEO(国巨); AddInBom: yes; ModelId: 671aefced39d4c318694bba8bd8efd39; ModelName: R0402_L1.0-W0.5-H0.5; ModelTransform: 39.37,19.685,0,0,0,0,0,0.0005,0; Tolerance: ±1%; Power(Watts): 62.5mW; Overload Voltage (Max): 50V; Symbol: RC0402FR-07240RL; Device: RC0402FR-07240RL; LCSC Part Name: 厚膜电阻 240Ω ±1% 62.5mW; SupplierPart: C114755; ManufacturerPart: RC0402FR-07240RL; Supplier Footprint: 0402; JLCPCB Part Class: 扩展库; Datasheet: https://atta.szlcsc.com/upload/public/pdf/source/20180821/C275644_0D56F95EFF785E7D9A1FEF436B37DA78.pdf; Supplier: LCSC; ConvertToPcb: yes; FootprintName: R0402; Type: 厚膜电阻; Value: 240Ω; Temperature Coefficient: ±100ppm/℃; Operating Temperature Range: -55℃~+155℃
R27 R29 R30 R32-R50 R54 R56 R57 R59-R77 = RC0402FR-0751RL: 电阻类型:厚膜电阻;阻值:51Ω;精度:±1%;功率:62.5mW;最大工作电压:50V;温度系数:±100ppm/℃;; Manufacturer: YAGEO(国巨); AddInBom: yes; ModelId: 671aefced39d4c318694bba8bd8efd39; ModelName: R0402_L1.0-W0.5-H0.5; ModelTransform: 39.37,19.685,0,0,0,0,0,0.0005,0; Tolerance: ±1%; Power(Watts): 62.5mW; Overload Voltage (Max): 50V; Symbol: RC0402FR-0751RL; Device: RC0402FR-0751RL; LCSC Part Name: 厚膜电阻 51Ω ±1% 62.5mW; SupplierPart: C137960; ManufacturerPart: RC0402FR-0751RL; Supplier Footprint: 0402; JLCPCB Part Class: 扩展库; Datasheet: https://atta.szlcsc.com/upload/public/pdf/source/20181009/C309620_DA5935B6E1D48212CB7A533FE518B3C2.pdf; Supplier: LCSC; ConvertToPcb: yes; FootprintName: R0402; Type: 厚膜电阻; Value: 51Ω; Temperature Coefficient: ±100ppm/℃; Operating Temperature Range: -55℃~+155℃
R78 = 3224W-1-103E: 阻值:10kΩ;精度:±10%;功率:250mW;温度系数:±100ppm/℃;; Manufacturer: BOURNS; AddInBom: yes; ModelId: 275916ee8bd84c61996bdd88c018d160; ModelTransform: 188.976,153.543,0,180,0,0,0,-3.937,0; Tolerance: ±10%; Power(Watts): 250mW; Turns: 12; Symbol: 3224W-1-103E; Device: 3224W-1-103E; LCSC Part Name: 10kΩ ±10%; SupplierPart: C81348; ManufacturerPart: 3224W-1-103E; Supplier Footprint: SMD; JLCPCB Part Class: 扩展库; Datasheet: https://atta.szlcsc.com/upload/public/pdf/source/20160830/1472551532733.pdf; Supplier: LCSC; ConvertToPcb: yes; FootprintName: RES-ADJ-SMD_3224W; ModelName: RES-ADJ-SMD_3224W; Value: 10kΩ; Temperature Coefficient: ±100ppm/℃
R80 = RC0402FR-07560RL: 电阻类型:厚膜电阻;阻值:560Ω;精度:±1%;功率:62.5mW;最大工作电压:50V;温度系数:±100ppm/℃;; Manufacturer: YAGEO(国巨); AddInBom: yes; ModelId: 671aefced39d4c318694bba8bd8efd39; ModelName: R0402_L1.0-W0.5-H0.5; ModelTransform: 39.37,19.685,0,0,0,0,0,0.0005,0; Tolerance: ±1%; Power(Watts): 62.5mW; Overload Voltage (Max): 50V; Symbol: RC0402FR-07560RL; Device: RC0402FR-07560RL; LCSC Part Name: 厚膜电阻 560Ω ±1% 62.5mW; SupplierPart: C163460; ManufacturerPart: RC0402FR-07560RL; Supplier Footprint: 0402; JLCPCB Part Class: 扩展库; Datasheet: https://atta.szlcsc.com/upload/public/pdf/source/20181009/C309620_DA5935B6E1D48212CB7A533FE518B3C2.pdf; Supplier: LCSC; ConvertToPcb: yes; FootprintName: R0402; Type: 厚膜电阻; Value: 560Ω; Temperature Coefficient: ±100ppm/℃; Operating Temperature Range: -55℃~+155℃
R81-R83 R96 R97 R141 = RC0402FR-0710KL: 电阻类型:厚膜电阻;阻值:10kΩ;精度:±1%;功率:62.5mW;最大工作电压:50V;温度系数:±100ppm/℃;; Manufacturer: YAGEO(国巨); AddInBom: yes; ModelId: 671aefced39d4c318694bba8bd8efd39; ModelName: R0402_L1.0-W0.5-H0.5; ModelTransform: 39.37,19.685,0,0,0,0,0,0.0005,0; Tolerance: ±1%; Power(Watts): 62.5mW; Overload Voltage (Max): 50V; Symbol: RC0402FR-0710KL; Device: RC0402FR-0710KL; LCSC Part Name: 厚膜电阻 10kΩ ±1% 62.5mW; SupplierPart: C60490; ManufacturerPart: RC0402FR-0710KL; Supplier Footprint: 0402; JLCPCB Part Class: 扩展库; Datasheet: https://atta.szlcsc.com/upload/public/pdf/source/20170925/C131467_1506321478108990263.pdf; Supplier: LCSC; ConvertToPcb: yes; FootprintName: R0402; Type: 厚膜电阻; Value: 10kΩ; Temperature Coefficient: ±100ppm/℃; Operating Temperature Range: -55℃~+155℃
R84-R86 = RC0603FR-0775RL: 电阻类型:厚膜电阻;阻值:75Ω;精度:±1%;功率:100mW;最大工作电压:75V;温度系数:±100ppm/℃;; Manufacturer: YAGEO(国巨); AddInBom: yes; ModelId: fc143cca1e79419f9cd78b61e9279f08; ModelTransform: 31.8897,63.7794,0,90,0,0,0,0,0; Tolerance: ±1%; Power(Watts): 100mW; Overload Voltage (Max): 75V; Symbol: RC0603FR-0775RL; Device: RC0603FR-0775RL; LCSC Part Name: 厚膜电阻 75Ω ±1% 100mW; SupplierPart: C112309; ManufacturerPart: RC0603FR-0775RL; Supplier Footprint: 0603; JLCPCB Part Class: 扩展库; Datasheet: https://atta.szlcsc.com/upload/public/pdf/source/20180821/C275644_0D56F95EFF785E7D9A1FEF436B37DA78.pdf; Supplier: LCSC; ConvertToPcb: yes; FootprintName: R0603; ModelName: R0603; Type: 厚膜电阻; Value: 75Ω; Temperature Coefficient: ±100ppm/℃; Operating Temperature Range: -55℃~+155℃
R87 R102 R103 R112 = RC0402FR-071KL: 电阻类型:厚膜电阻;阻值:1kΩ;精度:±1%;功率:62.5mW;最大工作电压:50V;温度系数:±100ppm/℃;; Manufacturer: YAGEO(国巨); AddInBom: yes; ModelId: 671aefced39d4c318694bba8bd8efd39; ModelName: R0402_L1.0-W0.5-H0.5; ModelTransform: 39.37,19.685,0,0,0,0,0,0.0005,0; Tolerance: ±1%; Power(Watts): 62.5mW; Overload Voltage (Max): 50V; Symbol: RC0402FR-071KL; Device: RC0402FR-071KL; LCSC Part Name: 厚膜电阻 1kΩ ±1% 62.5mW; SupplierPart: C106235; ManufacturerPart: RC0402FR-071KL; Supplier Footprint: 0402; JLCPCB Part Class: 扩展库; Datasheet: https://atta.szlcsc.com/upload/public/pdf/source/20180927/C295883_E8D83085EA81BD7DE0B2B681138C15EE.pdf; Supplier: LCSC; ConvertToPcb: yes; FootprintName: R0402; Type: 厚膜电阻; Value: 1kΩ; Temperature Coefficient: ±100ppm/℃; Operating Temperature Range: -55℃~+155℃
R88-R95 R104-R111 = RC0402FR-072K7L: 电阻类型:厚膜电阻;阻值:2.7kΩ;精度:±1%;功率:62.5mW;最大工作电压:50V;温度系数:±100ppm/℃;; Manufacturer: YAGEO(国巨); AddInBom: yes; ModelId: 671aefced39d4c318694bba8bd8efd39; ModelName: R0402_L1.0-W0.5-H0.5; ModelTransform: 39.37,19.685,0,0,0,0,0,0.0005,0; Tolerance: ±1%; Power(Watts): 62.5mW; Overload Voltage (Max): 50V; Symbol: RC0402FR-072K7L; Device: RC0402FR-072K7L; LCSC Part Name: 厚膜电阻 2.7kΩ ±1% 62.5mW; SupplierPart: C138017; ManufacturerPart: RC0402FR-072K7L; Supplier Footprint: 0402; JLCPCB Part Class: 扩展库; Datasheet: https://atta.szlcsc.com/upload/public/pdf/source/20181009/C309620_DA5935B6E1D48212CB7A533FE518B3C2.pdf; Supplier: LCSC; ConvertToPcb: yes; FootprintName: R0402; Type: 厚膜电阻; Value: 2.7kΩ; Temperature Coefficient: ±100ppm/℃; Operating Temperature Range: -55℃~+155℃
R98 = RC0402FR-07510RL: 电阻类型:厚膜电阻;阻值:510Ω;精度:±1%;功率:62.5mW;最大工作电压:50V;温度系数:±100ppm/℃;; Manufacturer: YAGEO(国巨); AddInBom: yes; ModelId: 671aefced39d4c318694bba8bd8efd39; ModelName: R0402_L1.0-W0.5-H0.5; ModelTransform: 39.37,19.685,0,0,0,0,0,0.0005,0; Tolerance: ±1%; Power(Watts): 62.5mW; Overload Voltage (Max): 50V; Symbol: RC0402FR-07510RL; Device: RC0402FR-07510RL; LCSC Part Name: 厚膜电阻 510Ω ±1% 62.5mW; SupplierPart: C276273; ManufacturerPart: RC0402FR-07510RL; Supplier Footprint: 0402; JLCPCB Part Class: 扩展库; Datasheet: https://atta.szlcsc.com/upload/public/pdf/source/20180904/C276339_014E484F1DBA106FB92D45EABD5A1AC1.pdf; Supplier: LCSC; ConvertToPcb: yes; FootprintName: R0402; Type: 厚膜电阻; Value: 510Ω; Temperature Coefficient: ±100ppm/℃; Operating Temperature Range: -55℃~+155℃
R133 R136 R146 = RC0603FR-07100KL: 电阻类型:厚膜电阻;阻值:100kΩ;精度:±1%;功率:100mW;温度系数:±100ppm/℃;; Manufacturer: YAGEO(国巨); AddInBom: yes; ModelId: fc143cca1e79419f9cd78b61e9279f08; ModelTransform: 31.8897,63.7794,0,90,0,0,0,0,0; Tolerance: ±1%; Power(Watts): 100mW; Overload Voltage (Max): 75V; Symbol: RC0603FR-07100KL; Device: RC0603FR-07100KL; Supplier: LCSC; Supplier Part: C14675; Manufacturer Part: RC0603FR-07100KL; Value: 100kΩ; JLCPCB Part Class: Extended Part; LCSC Part Name: 厚膜电阻 100kΩ ±1% 100mW; Supplier Footprint: 0603; Datasheet: https://atta.szlcsc.com/upload/public/pdf/source/20140324/1457707028752.pdf; ConvertToPcb: yes; FootprintName: R0603; ModelName: R0603; Type: 厚膜电阻; Temperature Coefficient: ±100ppm/℃; Operating Temperature Range: -55℃~+155℃
R134 R137 = 0603WAF1803T5E: 电阻类型:厚膜电阻;阻值:180kΩ;功率:100mW;温度系数:±100ppm/℃;精度:±1%;; Manufacturer: UNI-ROYAL(厚声); AddInBom: yes; ModelId: fc143cca1e79419f9cd78b61e9279f08; ModelTransform: 31.8897,63.7794,0,90,0,0,0,0,0; Power(Watts): 100mW; Overload Voltage (Max): 75V; Tolerance: ±1%; Symbol: 0603WAF1803T5E; Device: 0603WAF1803T5E; Supplier: LCSC; Manufacturer Part: 0603WAF1803T5E; Supplier Part: C22827; Value: 180kΩ; JLCPCB Part Class: Extended Part; LCSC Part Name: 180kΩ ±1% 100mW 厚膜电阻; Supplier Footprint: 0603; Datasheet: https://atta.szlcsc.com/upload/public/pdf/source/20200306/C422600_1E6D84923E4A46A82E41ADD87F860B5C.pdf; ConvertToPcb: yes; FootprintName: R0603; ModelName: R0603; Type: 厚膜电阻; Temperature Coefficient: ±100ppm/℃; Operating Temperature Range: -55℃~+155℃
R135 = RC0402FR-07560KL: 电阻类型:厚膜电阻;阻值:560kΩ;精度:±1%;功率:62.5mW;最大工作电压:50V;温度系数:±100ppm/℃;; Manufacturer: YAGEO(国巨); AddInBom: yes; ModelId: 671aefced39d4c318694bba8bd8efd39; ModelName: R0402_L1.0-W0.5-H0.5; ModelTransform: 39.37,19.685,0,0,0,0,0,0.0005,0; Tolerance: ±1%; Power(Watts): 62.5mW; Overload Voltage (Max): 50V; Symbol: RC0402FR-07560KL; Device: RC0402FR-07560KL; LCSC Part Name: 厚膜电阻 560kΩ ±1% 62.5mW; SupplierPart: C137958; ManufacturerPart: RC0402FR-07560KL; Supplier Footprint: 0402; JLCPCB Part Class: 扩展库; Datasheet: https://atta.szlcsc.com/upload/public/pdf/source/20181009/C309620_DA5935B6E1D48212CB7A533FE518B3C2.pdf; Supplier: LCSC; ConvertToPcb: yes; FootprintName: R0402; Type: 厚膜电阻; Value: 560kΩ; Temperature Coefficient: ±100ppm/℃; Operating Temperature Range: -55℃~+155℃
R138 = 0402WGF1583TCE: 电阻类型:厚膜电阻;阻值:158kΩ;精度:±1%;功率:62.5mW;最大工作电压:50V;温度系数:±100ppm/℃;; Manufacturer: UNI-ROYAL(厚声); AddInBom: yes; ModelId: 671aefced39d4c318694bba8bd8efd39; ModelName: R0402_L1.0-W0.5-H0.5; ModelTransform: 39.37,19.685,0,0,0,0,0,0.0005,0; Tolerance: ±1%; Power(Watts): 62.5mW; Overload Voltage (Max): 50V; Symbol: 0402WGF1583TCE; Device: 0402WGF1583TCE; Supplier: LCSC; Supplier Part: C99856; Manufacturer Part: 0402WGF1583TCE; Value: 158kΩ; JLCPCB Part Class: 扩展库; LCSC Part Name: 158kΩ ±1% 62.5mW 厚膜电阻; Supplier Footprint: 0402; Datasheet: https://atta.szlcsc.com/upload/public/pdf/source/20200306/C422600_1E6D84923E4A46A82E41ADD87F860B5C.pdf; ConvertToPcb: yes; FootprintName: R0402; Type: 厚膜电阻; Temperature Coefficient: ±100ppm/℃; Operating Temperature Range: -55℃~+155℃
R140 = RC0402FR-071K8L: 电阻类型:厚膜电阻;阻值:1.8kΩ;精度:±1%;功率:62.5mW;最大工作电压:50V;温度系数:±100ppm/℃;; Manufacturer: YAGEO(国巨); AddInBom: yes; ModelId: 671aefced39d4c318694bba8bd8efd39; ModelName: R0402_L1.0-W0.5-H0.5; ModelTransform: 39.37,19.685,0,0,0,0,0,0.0005,0; Tolerance: ±1%; Power(Watts): 62.5mW; Overload Voltage (Max): 50V; Symbol: RC0402FR-071K8L; Device: RC0402FR-071K8L; LCSC Part Name: 厚膜电阻 1.8kΩ ±1% 62.5mW; SupplierPart: C163481; ManufacturerPart: RC0402FR-071K8L; Supplier Footprint: 0402; JLCPCB Part Class: 扩展库; Datasheet: https://atta.szlcsc.com/upload/public/pdf/source/20181009/C309620_DA5935B6E1D48212CB7A533FE518B3C2.pdf; Supplier: LCSC; ConvertToPcb: yes; FootprintName: R0402; Type: 厚膜电阻; Value: 1.8kΩ; Temperature Coefficient: ±100ppm/℃; Operating Temperature Range: -55℃~+155℃
R142 = AR03BTCX5001: 电阻类型:薄膜电阻;阻值:5kΩ;精度:±0.1%;功率:100mW;最大工作电压:50V;温度系数:±25ppm/℃;; Manufacturer: Viking(光颉); AddInBom: yes; ModelId: fc143cca1e79419f9cd78b61e9279f08; ModelTransform: 31.8897,63.7794,0,90,0,0,0,0,0; Tolerance: ±0.1%; Power(Watts): 100mW; Overload Voltage (Max): 50V; Symbol: AR03BTCX5001; Device: AR03BTCX5001; LCSC Part Name: 薄膜电阻 5kΩ ±0.1% 100mW; SupplierPart: C2828621; ManufacturerPart: AR03BTCX5001; Supplier Footprint: 0603; JLCPCB Part Class: 扩展库; Datasheet: https://atta.szlcsc.com/upload/public/pdf/source/20211009/C2828650_32843A9D611245FFE6ACF70CB68068A1.pdf; Supplier: LCSC; ConvertToPcb: yes; FootprintName: R0603; ModelName: R0603; Type: 薄膜电阻; Value: 5kΩ; Temperature Coefficient: ±25ppm/℃; Operating Temperature Range: -55℃~+155℃
R143-R145 R147 R148 = RC0805FR-073K3L: 电阻类型:厚膜电阻;阻值:3.3kΩ;精度:±1%;功率:125mW;最大工作电压:150V;温度系数:±100ppm/℃;; Manufacturer: YAGEO(国巨); Symbol: RC0402FR-074K7L; AddInBom: yes; ModelId: 37a81e68749a4138bd2dfa6897b24b85; ModelName: R0805_L2.0-W1.3-H0.6; ModelTransform: 78.74,51.181,0,0,0,0,0,-0.0005,0; Tolerance: ±1%; Power(Watts): 125mW; Overload Voltage (Max): 150V; Device: RC0805FR-073K3L; LCSC Part Name: 厚膜电阻 3.3kΩ ±1% 125mW; SupplierPart: C114531; ManufacturerPart: RC0805FR-073K3L; Supplier Footprint: 0805; JLCPCB Part Class: Extended Part; Datasheet: https://atta.szlcsc.com/upload/public/pdf/source/20180821/C275644_0D56F95EFF785E7D9A1FEF436B37DA78.pdf; Supplier: LCSC; ConvertToPcb: yes; FootprintName: R0805; Type: 厚膜电阻; Value: 3.3kΩ; Temperature Coefficient: ±100ppm/℃; Operating Temperature Range: -55℃~+155℃
R150 R168 R169 = RC0402FR-0710KL: 电阻类型:厚膜电阻;阻值:10kΩ;精度:±1%;功率:62.5mW;最大工作电压:50V;温度系数:±100ppm/℃;; Manufacturer: YAGEO(国巨); Symbol: RC0402FR-07100KL; AddInBom: yes; ModelId: 671aefced39d4c318694bba8bd8efd39; ModelName: R0402_L1.0-W0.5-H0.5; ModelTransform: 39.37,19.685,0,0,0,0,0,0.0005,0; Tolerance: ±1%; Power(Watts): 62.5mW; Overload Voltage (Max): 50V; JLCPCB Part Class: Extended Part; Device: RC0402FR-0710KL; LCSC Part Name: 厚膜电阻 10kΩ ±1% 62.5mW; SupplierPart: C60490; ManufacturerPart: RC0402FR-0710KL; Supplier Footprint: 0402; Datasheet: https://atta.szlcsc.com/upload/public/pdf/source/20170925/C131467_1506321478108990263.pdf; Supplier: LCSC; ConvertToPcb: yes; FootprintName: R0402; Type: 厚膜电阻; Value: 10kΩ; Temperature Coefficient: ±100ppm/℃; Operating Temperature Range: -55℃~+155℃
R155 R156 R186-R189 = RC0402FR-07100RL: 电阻类型:厚膜电阻;阻值:100Ω;精度:±1%;功率:62.5mW;最大工作电压:50V;温度系数:±100ppm/℃;; Manufacturer: YAGEO(国巨); AddInBom: yes; ModelId: 671aefced39d4c318694bba8bd8efd39; ModelName: R0402_L1.0-W0.5-H0.5; ModelTransform: 39.37,19.685,0,0,0,0,0,0.0005,0; Tolerance: ±1%; Power(Watts): 62.5mW; Overload Voltage (Max): 50V; Symbol: RC0402FR-07100RL; Device: RC0402FR-07100RL; LCSC Part Name: 厚膜电阻 100Ω ±1% 62.5mW; SupplierPart: C106232; ManufacturerPart: RC0402FR-07100RL; Supplier Footprint: 0402; JLCPCB Part Class: 扩展库; Datasheet: https://atta.szlcsc.com/upload/public/pdf/source/20180927/C295883_E8D83085EA81BD7DE0B2B681138C15EE.pdf; Supplier: LCSC; ConvertToPcb: yes; FootprintName: R0402; Type: 厚膜电阻; Value: 100Ω; Temperature Coefficient: ±100ppm/℃; Operating Temperature Range: -55℃~+155℃
RN1 RN4-RN9 RN11-RN25 RN27 RN28 = YC124-FR-0733RL: 电阻器数:4;阻值:33Ω;精度:±1%;单个元件功率:62.5mW;温度系数:±200ppm/℃;; Manufacturer: YAGEO(国巨); Symbol: YC164-JR-0733RL; AddInBom: yes; ModelId: 24809bea39114057b1cb601d1f696a88; ModelName: R0402-8P_L2.0-W1.0-H0.5; ModelTransform: 78.74,39.37,0,180,0,0,-0.001,-0.001,0; Number of Resistors: 4; Tolerance: ±1%; Power(Watts): 62.5mW; Device: YC124-FR-0733RL; LCSC Part Name: 33Ω ±1% 0402x4; SupplierPart: C136851; ManufacturerPart: YC124-FR-0733RL; Supplier Footprint: 0402x4; JLCPCB Part Class: Extended Part; Datasheet: https://atta.szlcsc.com/upload/public/pdf/source/20180730/C256814_200CCA6CC84D78D7E49AE6680727F338.pdf; Supplier: LCSC; ConvertToPcb: yes; FootprintName: RES-ARRAY-SMD_0402-8P-L2.0-W1.0-BL; Value: 33Ω; Temperature Coefficient: ±200ppm/℃; Number of Pins: 8
RN2 RN3 = 4D03WGJ0103T5E: 电阻器数:4;阻值:10kΩ;精度:±5%;单个元件功率:62.5mW;温度系数:±200ppm/℃;; Manufacturer: UNI-ROYAL(厚声); AddInBom: yes; ModelId: edf39f9a2dca4b9a94267f442dd4f95a; ModelName: R0603-8P_L3.2-W1.6-H0.6; ModelTransform: 125.984,62.992,0,0,0,0,0,0,0; Number of Resistors: 4; Tolerance: ±5%; Power(Watts): 62.5mW; Symbol: 4D03WGJ0103T5E; Device: 4D03WGJ0103T5E; Supplier: LCSC; Manufacturer Part: 4D03WGJ0103T5E; Supplier Part: C29718; Value: 10kΩ; JLCPCB Part Class: 基础库; LCSC Part Name: 10kΩ ±5%; Supplier Footprint: 0603x4; Datasheet: https://atta.szlcsc.com/upload/public/pdf/source/20191224/C474318_2527498AE30E813171187CCD28401A71.pdf; ConvertToPcb: yes; FootprintName: RES-ARRAY-SMD_0603-8P-L3.2-W1.6-BL; Temperature Coefficient: ±200ppm/℃; Number of Pins: 8
SW1 SW2 = DSHP04TSGET: 类型:平拨,凹槽式;电路结构:单刀单掷;开关位数:4位;使用寿命:-;颜色:黑色;; Manufacturer: YE; Symbol: DSHP04TSGER; AddInBom: yes; ModelId: b2befa536a1540fdaa2fbf17f7bfbd64; ModelName: SW-SMD_8P-L6.7-W5.4-H2.3-LS8.4-P1.27; ModelTransform: 262.992,342.519,0,180,0,0,0.004,0,0; Circuit: 单刀单掷; Number of Positions: 4位; Device: DSHP04TSGET; Supplier: LCSC; Manufacturer Part: DSHP04TSGET; Supplier Part: C40736; JLCPCB Part Class: 扩展库; LCSC Part Name: 4位 1.27间距 拨码开关; Supplier Footprint: SMD-8P,5.4x6.6mm; Datasheet: https://atta.szlcsc.com/upload/public/pdf/source/20150928/1457707425288.pdf; ConvertToPcb: yes; FootprintName: SW-SMD_8P-L6.7-W5.4-P1.27-LS8.4; Type: 平拨,凹槽式; Lead Pitch: 1.27mm; Operating Life: -; Color: 黑色